# EAGLE design eskeetit (EAGLE 9.3.0)
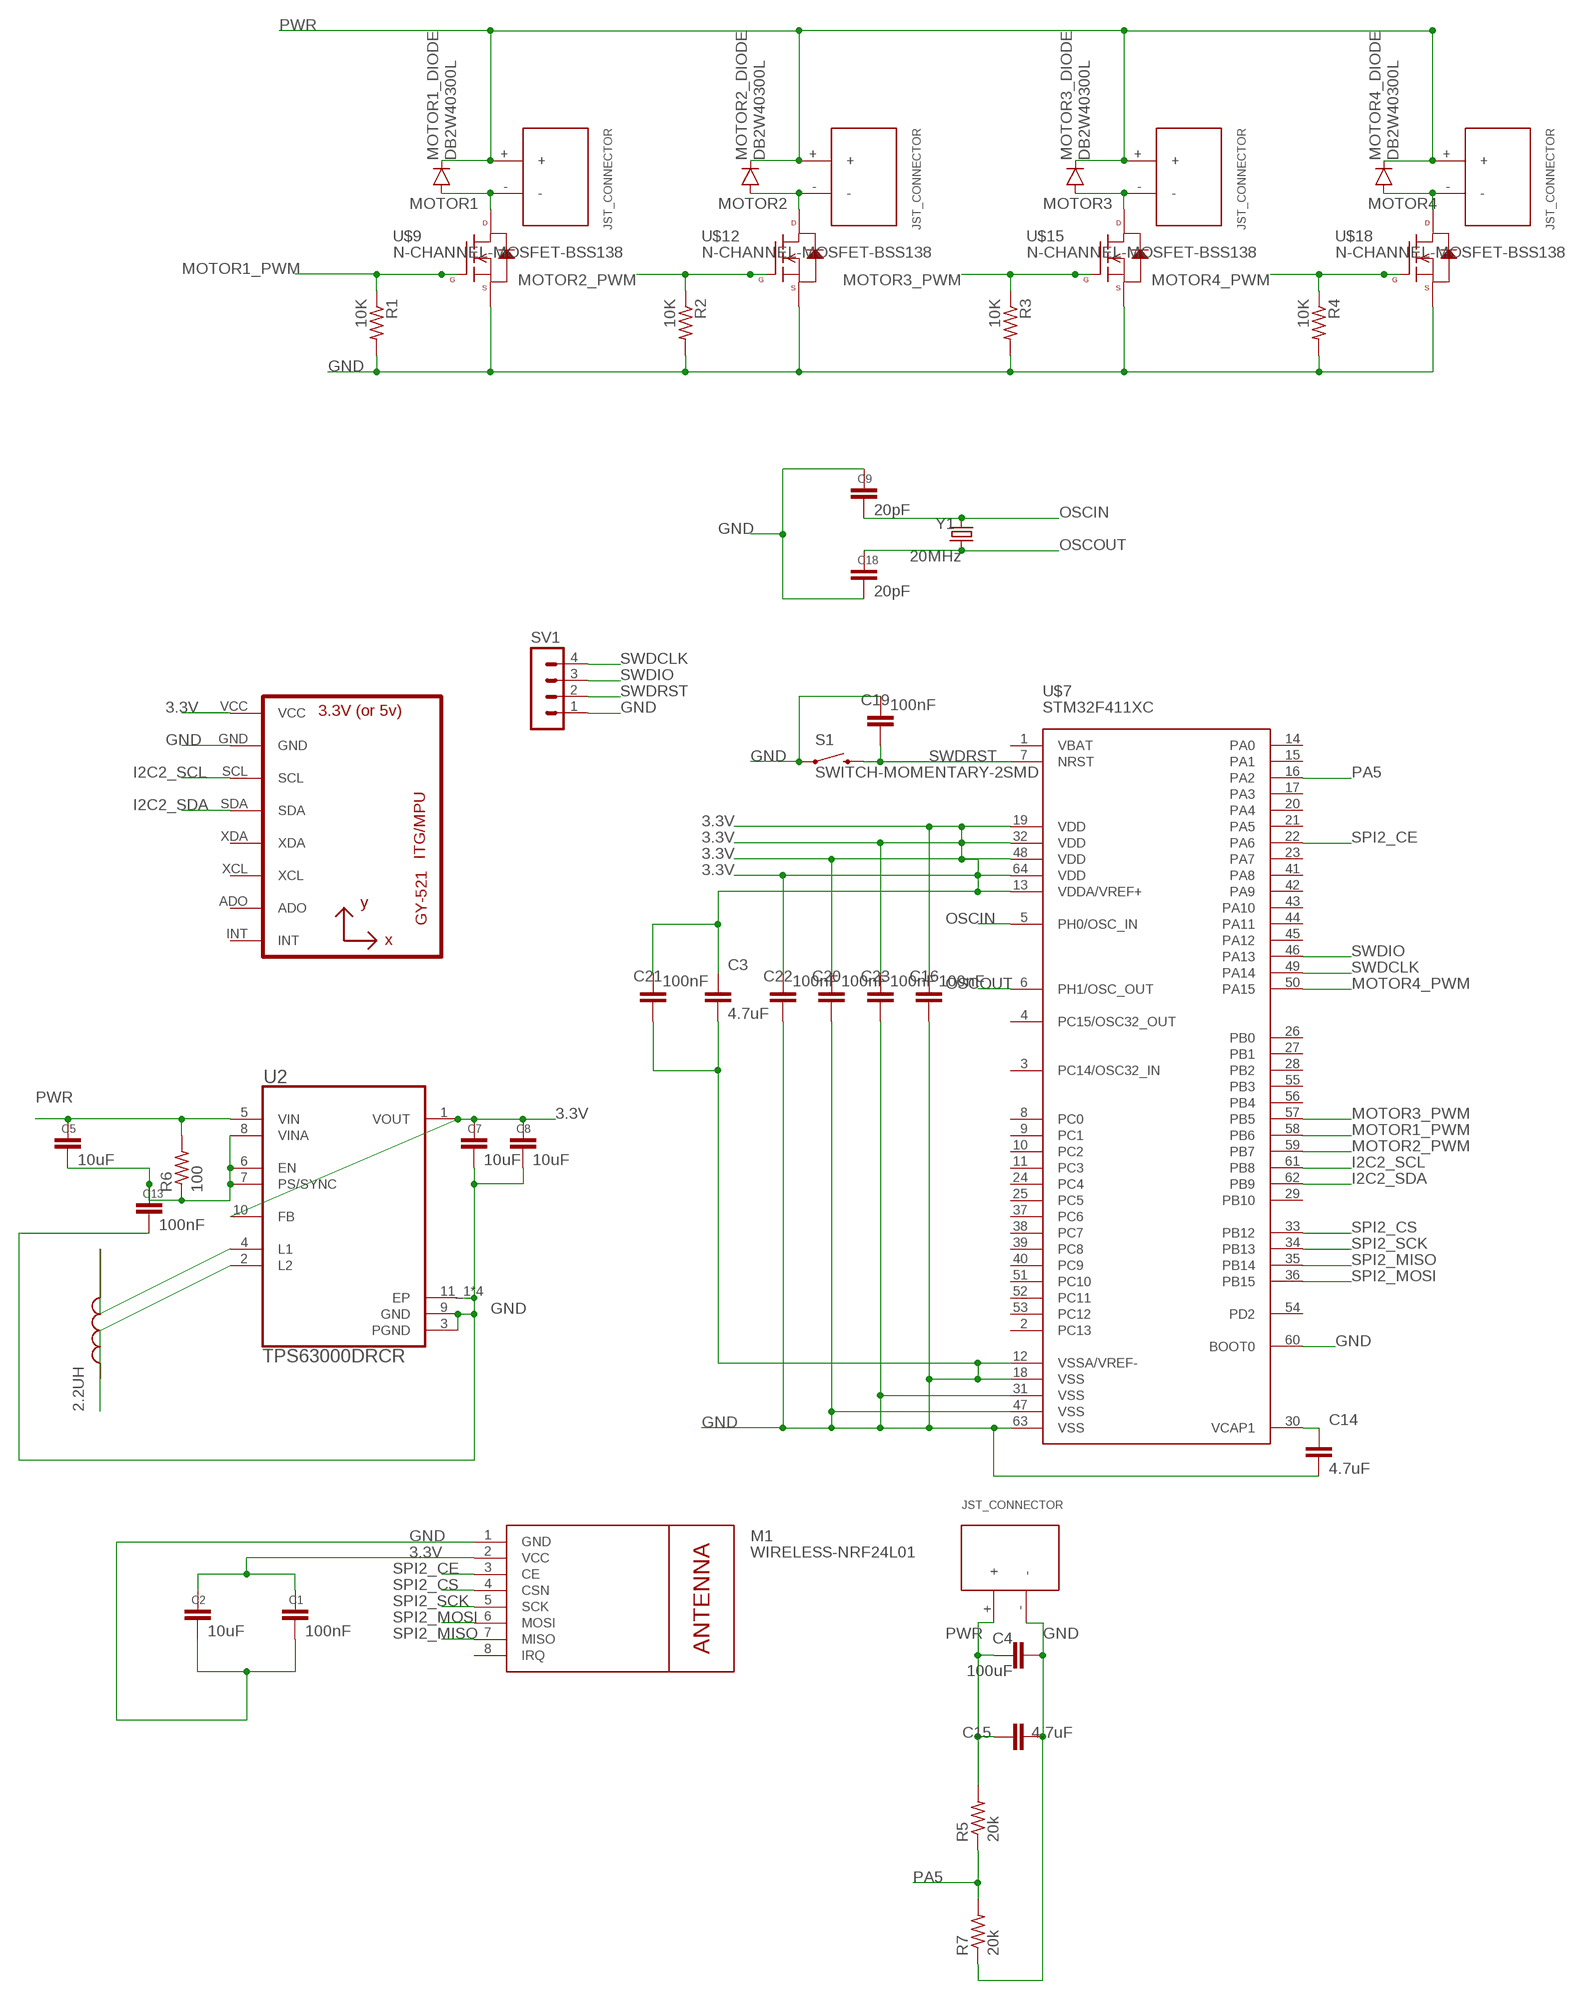
[diagram p0: schematic, sheet 1]

## Parts
2.2UH  2.2uH  LQH2MCN100K02L  [IND_LQH2MCN100K02L]
C1  100nF  RCL_C-EUC0603  [RCL_C0603]
C2  10uF  RCL_C-EUC0603  [RCL_C0603]
C3  4.7uF  RCL_C-EUC0603  [RCL_C0603]
C4  100uF  C-EUC1206  [C1206]
C5  10uF  RCL_C-EUC0603  [RCL_C0603]
C7  10uF  RCL_C-EUC0603  [RCL_C0603]
C8  10uF  RCL_C-EUC0603  [RCL_C0603]
C9  20pF  RCL_C-EUC0603  [RCL_C0603]
C13  100nF  RCL_C-EUC0603  [RCL_C0603]
C14  4.7uF  RCL_C-EUC0603  [RCL_C0603]
C15  4.7uF  RCL_C-EUC0603  [RCL_C0603]
C16  100nF  RCL_C-EUC0603  [RCL_C0603]
C18  20pF  RCL_C-EUC0603  [RCL_C0603]
C19  100nF  RCL_C-EUC0603  [RCL_C0603]
C20  100nF  RCL_C-EUC0603  [RCL_C0603]
C21  100nF  RCL_C-EUC0603  [RCL_C0603]
C22  100nF  RCL_C-EUC0603  [RCL_C0603]
C23  100nF  RCL_C-EUC0603  [RCL_C0603]
M1  WIRELESS-NRF24L01  [WIRELESS-NRF24L01]
MOTOR1  JST_CONNECTOR_FEMALE  [JST_CONNECTOR_FEMALE]
MOTOR1_DIODE  DB2W40300L  [MINI2-F3-B]
MOTOR2_DIODE  DB2W40300L  [MINI2-F3-B]
MOTOR3_DIODE  DB2W40300L  [MINI2-F3-B]
MOTOR4_DIODE  DB2W40300L  [MINI2-F3-B]
R1  10K  R-US_R0603  [R0603]
R2  10K  R-US_R0603  [R0603]
R3  10K  R-US_R0603  [R0603]
R4  10K  R-US_R0603  [R0603]
R5  20k  R-US_R0603  [R0603]
R6  100  R-US_R0603  [R0603]
R7  20k  R-US_R0603  [R0603]
S1  SWITCH-MOMENTARY-2SMD  [TACTILE-SWITCH-SMD]
SV1  MA04-1  [MA04-1]
U1  GY-521MPU6050  [GY-521]
U2  TPS63000DRCR  [CONV_TPS63000DRCR]
U$1  JST_CONNECTOR_FEMALE  [JST_CONNECTOR_FEMALE]
U$7  STM32F411XC  [LQFP64]
U$9  N-CHANNEL-MOSFET-BSS138  [SOT23-3]
U$11  JST_CONNECTOR_FEMALE  [JST_CONNECTOR_FEMALE]
U$12  N-CHANNEL-MOSFET-BSS138  [SOT23-3]
U$14  JST_CONNECTOR_FEMALE  [JST_CONNECTOR_FEMALE]
U$15  N-CHANNEL-MOSFET-BSS138  [SOT23-3]
U$17  JST_CONNECTOR_FEMALE  [JST_CONNECTOR_FEMALE]
U$18  N-CHANNEL-MOSFET-BSS138  [SOT23-3]
Y1  20MHz  CRYSTALHC49US  [HC49US]

## Nets
3.3V: C1.1 C2.1 C3.1 C7.1 C8.1 C16.1 C20.1 C21.1 C22.1 C23.1 M1.2(VCC) U1.VCC U2.1(VOUT) U2.10(FB) U$7.13(VDDA/VREF+) U$7.19(VDD) U$7.32(VDD) U$7.48(VDD) U$7.64(VDD)
GND: C1.2 C2.2 C3.2 C4.1 C7.2 C8.2 C9.1 C13.2 C14.2 C15.2 C16.2 C18.2 C19.1 C20.2 C21.2 C22.2 C23.2 M1.1(GND) R1.2 R2.2 R3.2 R4.2 R7.1 S1.1 SV1.1 U1.GND U2.3(PGND) U2.9(GND) U2.11_1(EP) U2.11_2(EP) U2.11_3(EP) U2.11_4(EP) U$1.- U$7.12(VSSA/VREF-) U$7.18(VSS) U$7.31(VSS) U$7.47(VSS) U$7.60(BOOT0) U$7.63(VSS) U$9.2(S) U$12.2(S) U$15.2(S) U$18.2(S)
I2C2_SCL: U1.SCL U$7.61(PB8)
I2C2_SDA: U1.SDA U$7.62(PB9)
MOTOR1: MOTOR1.- MOTOR1_DIODE.POS(PPIN) U$9.3(D)
MOTOR1_PWM: R1.1 U$7.58(PB6) U$9.1(G)
MOTOR2: MOTOR2_DIODE.POS(PPIN) U$11.- U$12.3(D)
MOTOR2_PWM: R2.1 U$7.59(PB7) U$12.1(G)
MOTOR3: MOTOR3_DIODE.POS(PPIN) U$14.- U$15.3(D)
MOTOR3_PWM: R3.1 U$7.57(PB5) U$15.1(G)
MOTOR4: MOTOR4_DIODE.POS(PPIN) U$17.- U$18.3(D)
MOTOR4_PWM: R4.1 U$7.50(PA15) U$18.1(G)
N$1: 2.2UH.2 U2.4(L1)
N$2: 2.2UH.1 U2.2(L2)
N$3: C5.2 C13.1 R6.1 U2.6(EN) U2.7(PS/SYNC) U2.8(VINA)
N$4: C14.1 U$7.30(VCAP1)
OSCIN: C9.2 U$7.5(PH0/OSC_IN) Y1.2
OSCOUT: C18.1 U$7.6(PH1/OSC_OUT) Y1.1
PA5: R5.1 R7.2 U$7.16(PA2)
PWR: C4.2 C5.1 C15.1 MOTOR1.+ MOTOR1_DIODE.NEG(GPIN) MOTOR2_DIODE.NEG(GPIN) MOTOR3_DIODE.NEG(GPIN) MOTOR4_DIODE.NEG(GPIN) R5.2 R6.2 U2.5(VIN) U$1.+ U$11.+ U$14.+ U$17.+
SPI2_CE: M1.3(CE) U$7.22(PA6)
SPI2_CS: M1.4(CSN) U$7.33(PB12)
SPI2_MISO: M1.7(MISO) U$7.35(PB14)
SPI2_MOSI: M1.6(MOSI) U$7.36(PB15)
SPI2_SCK: M1.5(SCK) U$7.34(PB13)
SWDCLK: SV1.4 U$7.49(PA14)
SWDIO: SV1.3 U$7.46(PA13)
SWDRST: C19.2 S1.3 SV1.2 U$7.7(NRST)
Unconnected: M1.8(IRQ) U1.ADO U1.INT U1.XCL U1.XDA U$7.1(VBAT) U$7.2(PC13) U$7.3(PC14/OSC32_IN) U$7.4(PC15/OSC32_OUT) U$7.8(PC0) U$7.9(PC1) U$7.10(PC2) U$7.11(PC3) U$7.14(PA0) U$7.15(PA1) U$7.17(PA3) U$7.20(PA4) U$7.21(PA5) U$7.23(PA7) U$7.24(PC4) U$7.25(PC5) U$7.26(PB0) U$7.27(PB1) U$7.28(PB2) U$7.29(PB10) U$7.37(PC6) U$7.38(PC7) U$7.39(PC8) U$7.40(PC9) U$7.41(PA8) U$7.42(PA9) U$7.43(PA10) U$7.44(PA11) U$7.45(PA12) U$7.51(PC10) U$7.52(PC11) U$7.53(PC12) U$7.54(PD2) U$7.55(PB3) U$7.56(PB4)

## Library data of the parts
2.2UH = LQH2MCN100K02L:LQH2MCN100K02L: Inductor Power Chip Unshielded Wirewound 82uH 10% 1MHz Ferrite 0.09A 9.75Ohm DCR 0806 T/R; DESCRIPTION: 10µH Unshielded Wirewound Inductor 225mA 1.56Ohm Max 0806 _2016 Metric_; DIGI-KEY_PART_NUMBER: 490-4046-1-ND; DIGI-KEY_PURCHASE_URL: https://www.digikey.com/product-detail/en/murata-electronics/LQH2MCN100K02L/490-4046-1-ND/1016306?utm_source=snapeda&utm_medium=aggregator&utm_campaign=symbol; MF: Murata Electronics; MP: LQH2MCN100K02L; PACKAGE: NONSTANDARD
C1-C3 C5 C7-C9 C13-C16 C18-C23 = capstone:RCL_C-EU: CAPACITOR, European symbol; SPICEPREFIX: C
C4 = rcl:C-EU: CAPACITOR, European symbol; SPICEPREFIX: C
M1 = AP_quad:WIRELESS-NRF24L01: 2.4 GHz Wireless Module based on NRF24L01 chip
MOTOR1 U$1 U$11 U$14 U$17 = AP_quad:JST_CONNECTOR_FEMALE
MOTOR1_DIODE MOTOR2_DIODE MOTOR3_DIODE MOTOR4_DIODE = AP_quad:DB2W40300L
R1-R7 = rcl:R-US_: RESISTOR, American symbol; SPICEPREFIX: R
S1 = Aircopter_quad_lib:SWITCH-MOMENTARY-2: Various NO switches- pushbuttons, reed, etc; PROD_ID: SWCH-08247
SV1 = con-lstb:MA04-1: PIN HEADER; OC_FARNELL: unknown; OC_NEWARK: unknown
U1 = AP_quad:GY-521
U2 = TPS63000DRCR:TPS63000DRCR: 96% Buck-Boost Converter with 1.8A Current Switches in 3x3 QFN 10-VSON -40 to 85; DESCRIPTION: Buck-Boost Switching Regulator IC Positive Adjustable 1.2V 1 Output 1.6A _Switch_ 10-VFDFN Exposed Pad; DIGI-KEY_PART_NUMBER: 296-19641-1-ND; DIGI-KEY_PURCHASE_URL: https://www.digikey.com/product-detail/en/texas-instruments/TPS63000DRCR/296-19641-1-ND/1016511?utm_source=snapeda&utm_medium=aggregator&utm_campaign=symbol; MF: Texas Instruments; MP: TPS63000DRCR; PACKAGE: VFDFN-10 Texas Instruments
U$7 = Aircopter_quad_lib:STM32F411XC: STM32F411XC
U$9 U$12 U$15 U$18 = AP_quad:N-CHANNEL-MOSFET: N-Channel MOSFET Mode Field Effect Transistor; DATASHEET: http://www.fairchildsemi.com/ds/BS/BSS138.pdf; DIGIKEY: BSS138TR-ND; ELEMENT14: 2323154; URL: http://au.element14.com/fairchild-semiconductor/bss138/mosfet-n-ch-50v-220ma-sot-23/dp/2323154
Y1 = AP_quad:CRYSTAL: Crystals Various standard crystals. Proven footprints. Spark Fun Electronics SKU : COM-00534

## Board
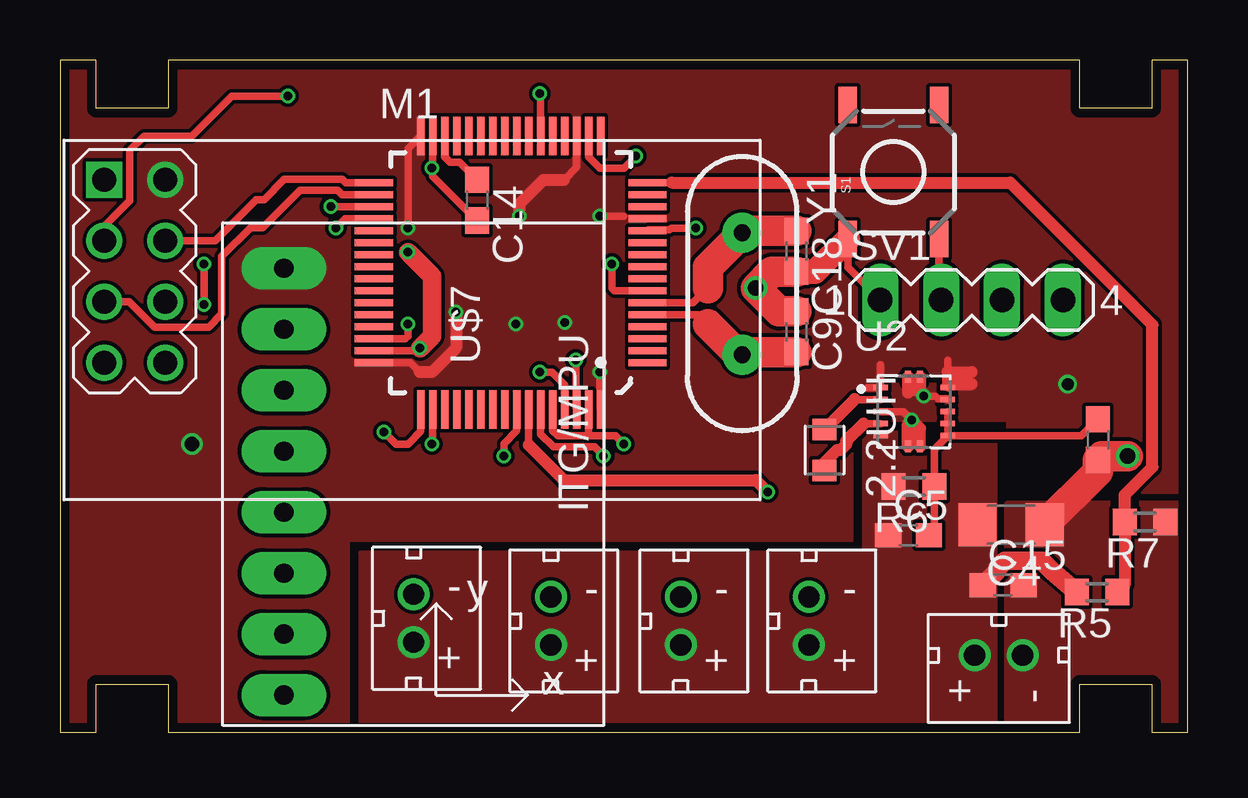
[diagram p1: board, top side]
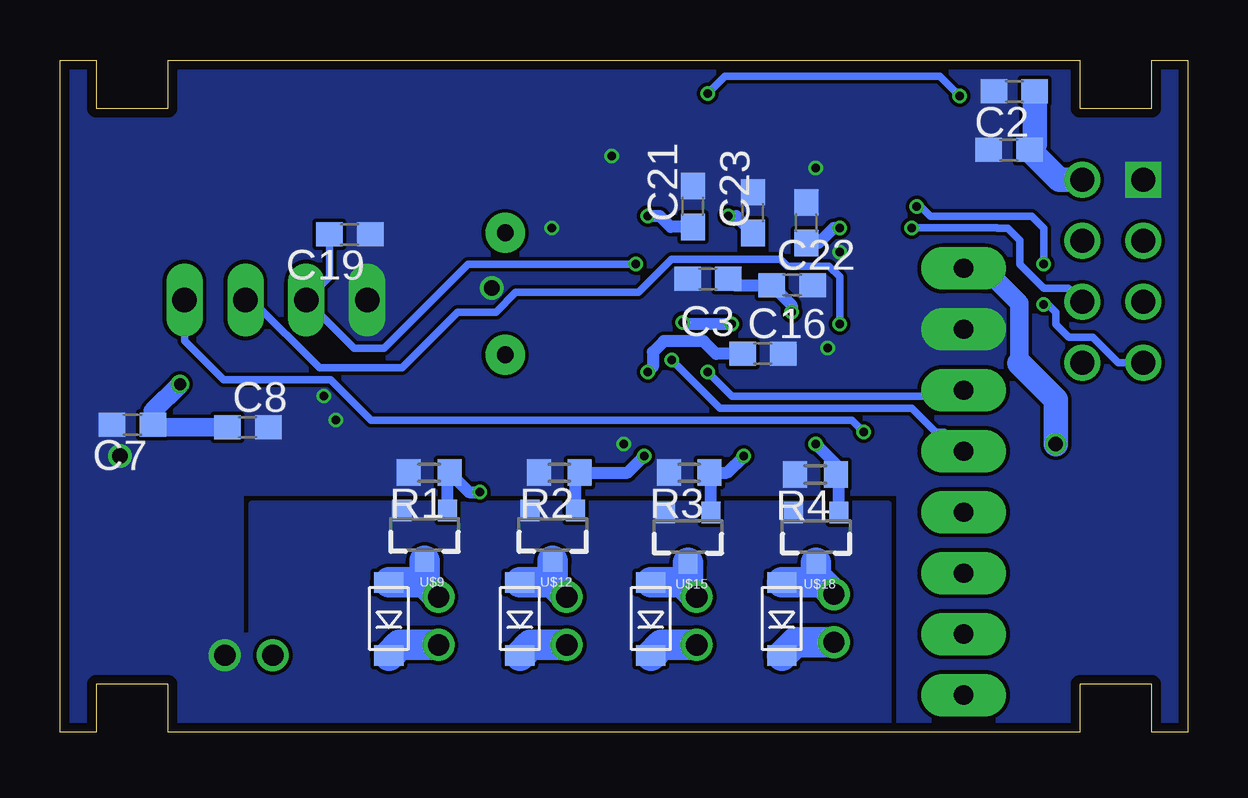
[diagram p2: board, bottom side, seen from below]

Size 47 x 28 mm. Coordinates in mm from the lower left corner, seen from the top.
Outline: 0,0 1.5,0 1.5,2 4.5,2 4.5,0 42.5,0 42.5,2 45.5,2 45.5,0 47,0 47,28 45.5,28 45.5,26 42.5,26 42.5,28 4.5,28 4.5,26 1.5,26 1.5,28 0,28 0,0
Copper layers (1*16): Top 0.035559375mm / dielectric 1.6mm / Bottom 0.035559375mm
Design rules "oshpark": minimum track width 6mil, minimum drill 10mil, track to track 6mil, track to pad 6mil, pad to pad 6mil, via to via 6mil, smd to smd 6mil, copper to edge 15mil, drill to drill 6mil, minimum pad ring 5mil, minimum via ring 5mil, stop-mask expansion 2.5mil, vias tented up to drill 0mil, thermal gap 10mil

### Footprints (pad centres in the part's own frame; a part is rotated, then mirrored left to right if it is on the bottom)
IND_LQH2MCN100K02L = smd 0.9 x 1: 1 -0.85,0; 2 0.85,0
RCL_C0603 = smd 1.1 x 1: 1 -0.85,0; 2 0.85,0
C1206 = smd 1.6 x 1.8: 1 -1.4,0; 2 1.4,0
WIRELESS-NRF24L01 = drill 1 square: 1 -12.7,6.35 | drill 1: 2 -10.16,6.35; 3 -12.7,3.81; 4 -10.16,3.81; 5 -12.7,1.27; 6 -10.16,1.27; 7 -12.7,-1.27; 8 -10.16,-1.27
JST_CONNECTOR_FEMALE = drill 0.889: + 0,1; - 0,-1
MINI2-F3-B = smd 1.22 x 0.85: NEG 0,1.55; POS 0,-1.5
R0603 = smd 1 x 1.1: 1 -0.85,0; 2 0.85,0
TACTILE-SWITCH-SMD = smd 1.524 x 0.762: 1 -2.794,1.905; 2 2.794,1.905; 3 -2.794,-1.905; 4 2.794,-1.905
MA04-1 = drill 1.016 long: 1 -3.81,0; 2 -1.27,0; 3 1.27,0; 4 3.81,0
GY-521 = drill 0.8 pad 1.778 long: ADO -8.89,-6.35; GND -8.89,6.35; INT -8.89,-8.89; SCL -8.89,3.81; SDA -8.89,1.27; VCC -8.89,8.89; XCL -8.89,-3.81; XDA -8.89,-1.27
CONV_TPS63000DRCR = smd 0.6 x 0.24: 1 -1.4,1; 2 -1.4,0.5; 3 -1.4,0; 4 -1.4,-0.5; 5 -1.4,-1; 6 1.4,-1; 7 1.4,-0.5; 8 1.4,0; 9 1.4,0.5; 10 1.4,1 | smd 0.25 x 0.5: 11_1 -0.25,1.45; 11_2 0.25,1.45; 11_3 0.25,-1.45; 11_4 -0.25,-1.45
LQFP64 = smd 0.3 x 1.6: 1 -3.75,-5.7; 2 -3.25,-5.7; 3 -2.75,-5.7; 4 -2.25,-5.7; 5 -1.75,-5.7; 6 -1.25,-5.7; 7 -0.75,-5.7; 8 -0.25,-5.7; 9 0.25,-5.7; 10 0.75,-5.7; 11 1.25,-5.7; 12 1.75,-5.7; 13 2.25,-5.7; 14 2.75,-5.7; 15 3.25,-5.7; 16 3.75,-5.7; 33 3.75,5.7; 34 3.25,5.7; 35 2.75,5.7; 36 2.25,5.7; 37 1.75,5.7; 38 1.25,5.7; 39 0.75,5.7; 40 0.25,5.7; 41 -0.25,5.7; 42 -0.75,5.7; 43 -1.25,5.7; 44 -1.75,5.7; 45 -2.25,5.7; 46 -2.75,5.7; 47 -3.25,5.7; 48 -3.75,5.7 | smd 1.6 x 0.3: 17 5.7,-3.75; 18 5.7,-3.25; 19 5.7,-2.75; 20 5.7,-2.25; 21 5.7,-1.75; 22 5.7,-1.25; 23 5.7,-0.75; 24 5.7,-0.25; 25 5.7,0.25; 26 5.7,0.75; 27 5.7,1.25; 28 5.7,1.75; 29 5.7,2.25; 30 5.7,2.75; 31 5.7,3.25; 32 5.7,3.75; 49 -5.7,3.75; 50 -5.7,3.25; 51 -5.7,2.75; 52 -5.7,2.25; 53 -5.7,1.75; 54 -5.7,1.25; 55 -5.7,0.75; 56 -5.7,0.25; 57 -5.7,-0.25; 58 -5.7,-0.75; 59 -5.7,-1.25; 60 -5.7,-1.75; 61 -5.7,-2.25; 62 -5.7,-2.75; 63 -5.7,-3.25; 64 -5.7,-3.75
SOT23-3 = smd 0.8 x 0.9: 1 -0.95,-1; 2 0.95,-1; 3 0,1.1
HC49US = drill 0.7 pad 1.651: 1 -2.54,0; 2 2.54,0

### Placement (x,y rotation side)
2.2UH  31.87,11.75 270 top
C1  7.44,24.26 180 bottom
C2  7.22,26.69 180 bottom
C3  19.99,18.89 180 bottom
C4  39.64,8.63 180 top
C5  35.37,8.19 0 top
C7  43.98,12.81 180 bottom
C8  39.17,12.69 0 bottom
C9  30.69,16.68 270 top
C13  43.26,12.18 270 top
C14  17.39,22.16 270 top
C15  39.31,6.11 0 top
C16  17.7,15.76 0 bottom
C18  30.69,20.03 270 top
C19  34.92,20.74 180 bottom
C20  15.89,21.22 90 bottom
C21  20.61,21.9 90 bottom
C22  16.48,18.61 0 bottom
C23  18.11,21.64 90 bottom
M1  14.55,16.66 0 top
MOTOR1  31.22,4.63 180 top
MOTOR1_DIODE  33.29,4.73 180 bottom
MOTOR2_DIODE  27.83,4.73 180 bottom
MOTOR3_DIODE  22.37,4.73 180 bottom
MOTOR4_DIODE  16.91,4.73 180 bottom
R1  31.61,10.81 180 bottom
R2  26.19,10.81 180 bottom
R3  20.77,10.81 180 bottom
R4  15.51,10.73 180 bottom
R5  43.23,5.83 180 top
R6  35.59,10.23 180 top
R7  45.23,8.75 180 top
S1  34.74,23.33 90 top
SV1  38,18 0 top
U1  18.22,10.43 0 top
U2  35.6,13.35 0 top
U$1  39.13,3.2 90 top
U$7  18.79,19.14 90 top
U$9  31.8,8.23 180 bottom
U$11  25.88,4.63 180 top
U$12  26.46,8.23 180 bottom
U$14  20.46,4.63 180 top
U$15  20.82,8.15 180 bottom
U$17  14.74,4.74 180 top
U$18  15.48,8.15 180 bottom
Y1  28.44,18.26 270 top

### Tracks (layer width: path | path; a pad name or v marks a point on that pad's centre or on a via)
3.3V  (via drill 0.35, 0.5, 0.6)
  Top 0.305: v22.5,21.5 23.5,21.5 | U$7.19 21.54,23.54 21,23 | v14.5,21 14.5,24.3 U$7.32 | v22.5,15 22.5,13.48 U$7.64 | U$7.48 14.61,15.39 15,15 | 34.2,15.3 U2.1 33.65,14.35 | 37,15 37,15.5 | U2.10 37,14.45
  Top 0.508: 21,23 20.14,23 19.14,22 v19.14,21.5 | v16.5,17.5 16.5,16 15.5,15 15,15 | 38,15 37,15 37,14.45 37.05,14.5 38,14.5
  Bottom 0.508: C21.1 21.55,21.05 22,21.5 v22.5,21.5 | v19.14,21.5 18.82,21.5 C23.1 | C20.1 15.39,20.37 14.76,21 v14.5,21 | C16.1 19.65,15.76 20.18,16.29 21.82,16.29 22.29,15.82 22.29,15.21 v22.5,15 | C3.1 18.86,18.61 C22.1 16.5,17.78 v16.5,17.5 | v19,17 21,17 21.04,17.04 v21.04,17.07
  Bottom 0.762: v42,14.5 43.13,13.37 C7.1 43.01,12.69 C8.1 | U1.VCC 8.47,19.32 7.02,17.87 7.02,15.37
  Bottom 1.016: 7.02,15.37 5.5,13.85 v5.5,12 | C2.1 6.37,24.48 C1.1 5.34,23.01 M1.2
  pour Top (no thermals): -0.5,21.5 -0.5,29 47.5,29 47.5,10 39.5,10 39.5,13 37.5,13 37.5,15 34,15 34,13 33,13 33,8 12,8 12,-0.5 -0.5,-0.5 -0.5,21
GND  (via drill 0.35, 0.65)
  Top 0.305: U$7.12 24.54,20.93 25.42,20.93 25.48,21 v26.5,21 | 22,12.34 20.76,12.34 20.54,12.56 U$7.60 | v15.5,23.5 15.54,23.5 | U$7.31 15.54,23.5 | U$7.63 22.04,12.38 22,12.34 | S1.1 32.84,19.36 SV1.1 | U$7.47 14.89,15.89 v15,16 | v23.5,12 23.16,12.34 22,12.34 | U$7.18 22.04,23.96 22.26,23.73 22.27,23.73 22.5,23.5 23.5,23.5 v24,24 | U2.3 35.15,13.35 v35.5,13 | U2.9 36.96,13.89 36.61,13.89 36.5,14 v36,14 35.85,14.15 35.35,14.15 | C14.2 15.54,23.16 15.54,23.5
  Top 0.508: U2.11_3 35.85,12.65 v35.5,13 35.35,12.85 U2.11_4 | U2.11_1 35.35,14.15 | U2.11_2 35.85,14.15
  Top 0.762: v14.5,20 15.5,19 15.5,16.5 v15,16
  Top 1.016: C18.2 31.48,19.18 S1.1
  Top 1.27: C18.2 29.68,19.18 v29,18.5 29.97,17.53 C9.1 | v44.5,11.5 43.43,11.5 C13.2 43.26,10.85 C4.1
  pour Top (no thermals): 39.5,9.5 47.5,9.5 47.5,-0.5 39.5,-0.5
  pour Top: 34.5,14.5 37,14.5 37,13 34.5,13
  pour Bottom (no thermals): 39.5,4 39,4 39,9.5 12.5,9.5 12.5,-0.5 47.5,-0.5 47.5,28.5 48,29 -1.5,29 -1.5,-1 11.5,-1 12,-1.5 12,10 39.5,10
I2C2_SCL  (via drill 0.35)
  Top 0.305: U$7.61 21.04,14.46 20.5,15 v20,15
  Bottom 0.305: U1.SCL 9.57,14 19,14 v20,15
I2C2_SDA  (via drill 0.35)
  Top 0.305: U$7.62 21.5,13.48 v21.5,15.5
  Bottom 0.305: v21.5,15.5 19.5,13.5 11.5,13.5 10.5,12.5 10.13,12.5 U1.SDA
MOTOR1
  Bottom 1.27: MOTOR1.- 31.8,6.21 | 31.8,6.21 U$9.3 | MOTOR1_DIODE.POS 31.82,6.23 31.8,6.21
MOTOR1_PWM  (via drill 0.35)
  Top 0.305: 19.54,11.96 U$7.58
  Top 0.508: 19.54,11.96 21,10.5 29,10.5 v29.5,10
  Bottom 0.305: 30.85,10.72 R1.1
  Bottom 0.508: U$9.1 30.85,10.72 | R1.1 29.95,10 v29.5,10
MOTOR2
  Bottom 1.27: U$11.- 26.46,6.21 | 26.46,6.21 U$12.3 | MOTOR2_DIODE.POS 26.48,6.23 26.46,6.21
MOTOR2_PWM  (via drill 0.35)
  Top 0.305: U$7.59 20.04,12.41 20.57,11.88 22.27,11.88 v22.65,11.5
  Bottom 0.305: 25.51,10.64 R2.1
  Bottom 0.508: R2.1 23.34,10.81 v22.65,11.5 | U$12.1 25.51,10.64
MOTOR3
  Bottom 1.27: U$14.- 20.82,5.99 | 20.82,5.99 U$15.3 | MOTOR3_DIODE.POS 21.06,6.23 20.82,5.99
MOTOR3_PWM  (via drill 0.35)
  Top 0.305: v18.5,11.5 18.5,12.02 19.04,12.56 U$7.57
  Bottom 0.508: U$15.1 19.87,10.76 R3.1 19.19,10.81 v18.5,11.5
MOTOR4
  Bottom 1.27: U$18.3 15.48,6.48 U$17.- 15.23,6.23 MOTOR4_DIODE.POS
MOTOR4_PWM  (via drill 0.35)
  Top 0.305: U$7.50 15.54,12.04 v15.5,12
  Bottom 0.305: 14.53,10.6 R4.1
  Bottom 0.508: R4.1 14.66,11.16 v15.5,12 | U$18.1 14.53,10.6
N$1
  Top 0.305: U2.4 33.5,12.85
  Top 0.508: 2.2UH.2 31.87,11.22 32.39,11.74 32.54,11.74 32.78,11.98 32.78,12.13 33.5,12.85
N$2
  Top 0.305: U2.2 33.15,13.85 33.13,13.87
  Top 0.508: 33.13,13.87 2.2UH.1
N$3
  Top 0.305: C5.2 36.44,8.41 R6.1 36.44,11.79 U2.6 | U2.6 U2.7 U2.8 | U2.6 42.58,12.35 C13.1
N$4
  Top 0.305: C14.1 16.66,23.73 16.26,23.73 16.04,23.96 U$7.30
OSCIN
  Top 0.305: 27,17 26.61,17.39 U$7.5
  Top 1.27: C9.2 28.55,15.83 Y1.2 28.28,15.72 27,17
OSCOUT
  Top 0.305: U$7.6 26.39,17.89 27,18.5
  Top 1.27: C18.1 28.52,20.88 Y1.1 27,19.36 27,18.5
PA5
  Top 0.305: U$7.16 25.5,22.89
  Top 0.508: 25.5,22.89 39.61,22.89 45.54,16.96 45.54,11.04 44.38,9.88 R7.2 44.38,6.13 R5.1
PWR
  Top 0.762: R5.2 41.39,6.68 40.93,7.14 39.39,7.14 39.08,6.83 39.08,6.73 C15.1
  Bottom 1.27: U$17.+ 16.35,3.74 MOTOR4_DIODE.NEG | U$14.+ 21.92,3.63 MOTOR3_DIODE.NEG | U$11.+ 27.38,3.63 MOTOR2_DIODE.NEG | MOTOR1.+ 32.84,3.63 MOTOR1_DIODE.NEG
  pour Top (no thermals): 39,12.5 33.5,12.5 33.5,7.5 12.5,7.5 12.5,-0.5 39,-0.5
SPI2_CE  (via drill 0.35)
  Top 0.305: v20,26.61 20.04,26.57 U$7.22 | M1.3 1.85,21.07 2.91,22.13 2.91,24.24 3.5,24.83 5.48,24.83 7.15,26.5 v9.5,26.5
  Bottom 0.305: v9.5,26.5 10.33,27.33 19.27,27.33 v20,26.61
SPI2_CS
  Top 0.305: M1.4 6.47,20.47 8.18,22.18 8.5,22.18 9.35,23.03 11.76,23.03 11.9,22.89 U$7.33
SPI2_MISO  (via drill 0.35)
  Top 0.305: v6,17.82 v6,19.5 | U$7.35 v11.29,21.89
  Bottom 0.305: M1.7 2.89,15.39 3.95,16.45 4.95,16.45 5.5,17 5.5,17.5 5.82,17.82 v6,17.82 | v6,19.5 6,21 6.5,21.5 10.71,21.5 10.86,21.64 11.11,21.89 v11.29,21.89
SPI2_MOSI  (via drill 0.35)
  Top 0.305: U$7.36 11.89,21.39 v11.5,21
  Bottom 0.305: v11.5,21 11.49,21.01 7.95,21.01 7.93,21 7.5,21 7,20.5 7,19.5 6,18.5 4.96,18.5 M1.6
SPI2_SCK
  Top 0.305: M1.5 2.89,17.93 3.95,16.87 6.19,16.87 6.75,17.43 6.75,19.81 7.95,21.01 8.45,21.01 10,22.57 11.57,22.57 11.75,22.39 U$7.34
SWDCLK  (via drill 0.35)
  Top 0.305: v13.5,12.5 14,12 14.5,12 15.04,12.54 U$7.49
  Bottom 0.305: v13.5,12.5 14,13 34.03,13 35.72,14.68 40.18,14.68 41.81,16.31 SV1.4
SWDIO  (via drill 0.35)
  Top 0.305: v14.5,17 14.5,16.5 14.39,16.39 U$7.46
  Bottom 0.305: SV1.3 39,18 36.17,15.17 32.75,15.17 30.42,17.5 28.82,17.5 28,18.32 22.89,18.32 21.52,19.7 16.96,19.7 16.68,19.41 14.95,19.41 14.5,18.96 v14.5,17
SWDRST  (via drill 0.35)
  Top 0.305: S1.3 36.65,18.09 SV1.2 | v23,19.5 23,18.5 23.11,18.39 U$7.7
  Bottom 0.305: v23,19.5 30,19.5 33.5,16 34.73,16 SV1.2 35.77,18.96 C19.2